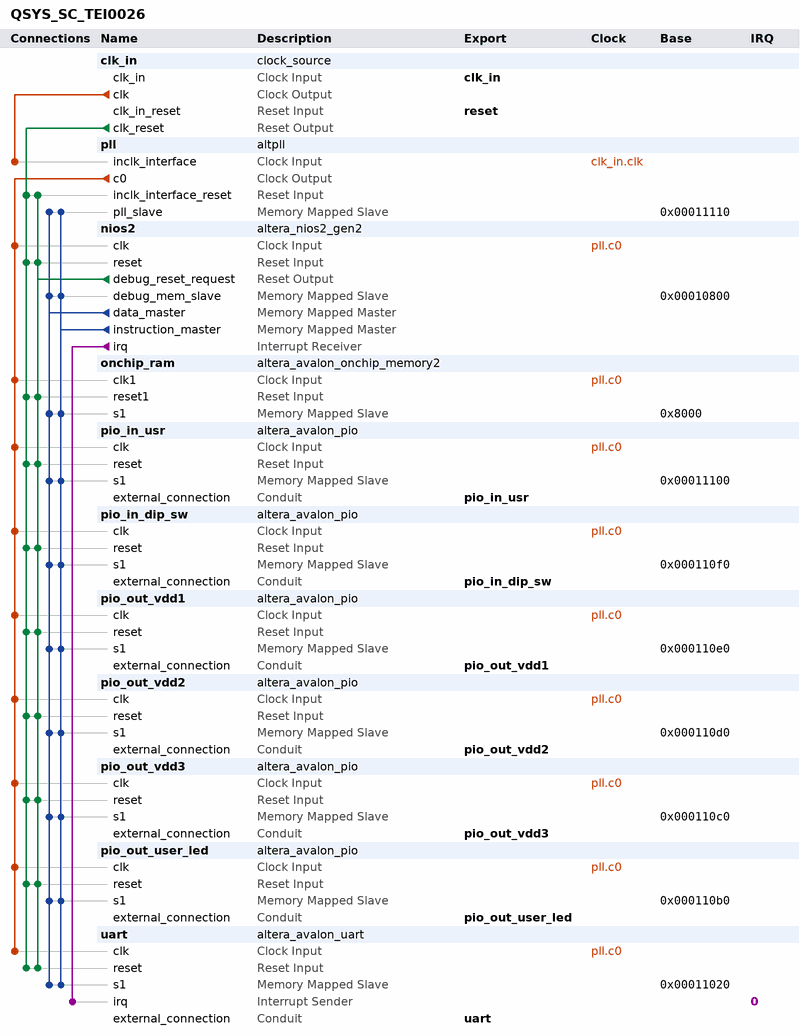
[diagram p0: system contents]
# Platform Designer (Qsys) system QSYS_SC_TEI0026, MAX 10 10M08SAU169C8G
# Parameters at their usual value, and those the tool derives, are not listed.
package require -exact qsys 19.1
create_system QSYS_SC_TEI0026
set_project_property DEVICE_FAMILY {MAX 10}
set_project_property DEVICE 10M08SAU169C8G

add_instance clk_in clock_source 19.1
set_instance_parameter_value clk_in clockFrequency 12000000

add_instance pll altpll 19.1
set_instance_parameter_value pll CLK0_DIVIDE_BY 3
set_instance_parameter_value pll CLK0_MULTIPLY_BY 25
set_instance_parameter_value pll INCLK0_INPUT_FREQUENCY 83333
set_instance_parameter_value pll PORT_ARESET PORT_UNUSED
set_instance_parameter_value pll PORT_LOCKED PORT_UNUSED
set_instance_parameter_value pll PORT_clk1 PORT_UNUSED
set_instance_parameter_value pll PORT_clk2 PORT_UNUSED
set_instance_parameter_value pll PORT_clk3 PORT_UNUSED

add_instance nios2 altera_nios2_gen2 19.1
set_instance_parameter_value nios2 dcache_size 2048
set_instance_parameter_value nios2 exceptionSlave onchip_ram.s1
set_instance_parameter_value nios2 icache_size 4096
set_instance_parameter_value nios2 impl Tiny
set_instance_parameter_value nios2 resetSlave onchip_ram.s1

add_instance onchip_ram altera_avalon_onchip_memory2 19.1
set_instance_parameter_value onchip_ram dataWidth 32
set_instance_parameter_value onchip_ram dualPort false
set_instance_parameter_value onchip_ram initMemContent true
set_instance_parameter_value onchip_ram initializationFileName ./software/SC_TEI0026/mem_init/onchip_ram.hex
set_instance_parameter_value onchip_ram memorySize 32768
set_instance_parameter_value onchip_ram useNonDefaultInitFile true

add_instance pio_in_usr altera_avalon_pio 19.1
set_instance_parameter_value pio_in_usr direction Input
set_instance_parameter_value pio_in_usr width 3

add_instance pio_in_dip_sw altera_avalon_pio 19.1
set_instance_parameter_value pio_in_dip_sw direction Input
set_instance_parameter_value pio_in_dip_sw width 4

add_instance pio_out_vdd1 altera_avalon_pio 19.1
set_instance_parameter_value pio_out_vdd1 direction Output
set_instance_parameter_value pio_out_vdd1 width 5

add_instance pio_out_vdd2 altera_avalon_pio 19.1
set_instance_parameter_value pio_out_vdd2 direction Output
set_instance_parameter_value pio_out_vdd2 width 6

add_instance pio_out_vdd3 altera_avalon_pio 19.1
set_instance_parameter_value pio_out_vdd3 direction Output
set_instance_parameter_value pio_out_vdd3 width 5

add_instance pio_out_user_led altera_avalon_pio 19.1
set_instance_parameter_value pio_out_user_led direction Output
set_instance_parameter_value pio_out_user_led width 4

add_instance uart altera_avalon_uart 19.1
set_instance_parameter_value uart baud 115200
set_instance_parameter_value uart dataBits 8
set_instance_parameter_value uart fixedBaud true
set_instance_parameter_value uart parity NONE
set_instance_parameter_value uart stopBits 1

# connections
add_connection clk_in.clk pll.inclk_interface clock
add_connection pll.c0 nios2.clk clock
add_connection pll.c0 onchip_ram.clk1 clock
add_connection pll.c0 pio_in_dip_sw.clk clock
add_connection pll.c0 pio_in_usr.clk clock
add_connection pll.c0 pio_out_user_led.clk clock
add_connection pll.c0 pio_out_vdd1.clk clock
add_connection pll.c0 pio_out_vdd2.clk clock
add_connection pll.c0 pio_out_vdd3.clk clock
add_connection pll.c0 uart.clk clock
add_connection clk_in.clk_reset nios2.reset reset
add_connection clk_in.clk_reset onchip_ram.reset1 reset
add_connection clk_in.clk_reset pio_in_dip_sw.reset reset
add_connection clk_in.clk_reset pio_in_usr.reset reset
add_connection clk_in.clk_reset pio_out_user_led.reset reset
add_connection clk_in.clk_reset pio_out_vdd1.reset reset
add_connection clk_in.clk_reset pio_out_vdd2.reset reset
add_connection clk_in.clk_reset pio_out_vdd3.reset reset
add_connection clk_in.clk_reset pll.inclk_interface_reset reset
add_connection clk_in.clk_reset uart.reset reset
add_connection nios2.debug_reset_request nios2.reset reset
add_connection nios2.debug_reset_request onchip_ram.reset1 reset
add_connection nios2.debug_reset_request pio_in_dip_sw.reset reset
add_connection nios2.debug_reset_request pio_in_usr.reset reset
add_connection nios2.debug_reset_request pio_out_user_led.reset reset
add_connection nios2.debug_reset_request pio_out_vdd1.reset reset
add_connection nios2.debug_reset_request pio_out_vdd2.reset reset
add_connection nios2.debug_reset_request pio_out_vdd3.reset reset
add_connection nios2.debug_reset_request pll.inclk_interface_reset reset
add_connection nios2.debug_reset_request uart.reset reset
add_connection nios2.data_master nios2.debug_mem_slave avalon
set_connection_parameter_value nios2.data_master/nios2.debug_mem_slave baseAddress 0x00010800
add_connection nios2.data_master onchip_ram.s1 avalon
set_connection_parameter_value nios2.data_master/onchip_ram.s1 baseAddress 0x8000
add_connection nios2.data_master pio_in_dip_sw.s1 avalon
set_connection_parameter_value nios2.data_master/pio_in_dip_sw.s1 baseAddress 0x000110f0
add_connection nios2.data_master pio_in_usr.s1 avalon
set_connection_parameter_value nios2.data_master/pio_in_usr.s1 baseAddress 0x00011100
add_connection nios2.data_master pio_out_user_led.s1 avalon
set_connection_parameter_value nios2.data_master/pio_out_user_led.s1 baseAddress 0x000110b0
add_connection nios2.data_master pio_out_vdd1.s1 avalon
set_connection_parameter_value nios2.data_master/pio_out_vdd1.s1 baseAddress 0x000110e0
add_connection nios2.data_master pio_out_vdd2.s1 avalon
set_connection_parameter_value nios2.data_master/pio_out_vdd2.s1 baseAddress 0x000110d0
add_connection nios2.data_master pio_out_vdd3.s1 avalon
set_connection_parameter_value nios2.data_master/pio_out_vdd3.s1 baseAddress 0x000110c0
add_connection nios2.data_master pll.pll_slave avalon
set_connection_parameter_value nios2.data_master/pll.pll_slave baseAddress 0x00011110
add_connection nios2.data_master uart.s1 avalon
set_connection_parameter_value nios2.data_master/uart.s1 baseAddress 0x00011020
add_connection nios2.instruction_master nios2.debug_mem_slave avalon
set_connection_parameter_value nios2.instruction_master/nios2.debug_mem_slave baseAddress 0x00010800
add_connection nios2.instruction_master onchip_ram.s1 avalon
set_connection_parameter_value nios2.instruction_master/onchip_ram.s1 baseAddress 0x8000
add_connection nios2.instruction_master pio_in_dip_sw.s1 avalon
set_connection_parameter_value nios2.instruction_master/pio_in_dip_sw.s1 baseAddress 0x000110f0
add_connection nios2.instruction_master pio_in_usr.s1 avalon
set_connection_parameter_value nios2.instruction_master/pio_in_usr.s1 baseAddress 0x00011100
add_connection nios2.instruction_master pio_out_user_led.s1 avalon
set_connection_parameter_value nios2.instruction_master/pio_out_user_led.s1 baseAddress 0x000110b0
add_connection nios2.instruction_master pio_out_vdd1.s1 avalon
set_connection_parameter_value nios2.instruction_master/pio_out_vdd1.s1 baseAddress 0x000110e0
add_connection nios2.instruction_master pio_out_vdd2.s1 avalon
set_connection_parameter_value nios2.instruction_master/pio_out_vdd2.s1 baseAddress 0x000110d0
add_connection nios2.instruction_master pio_out_vdd3.s1 avalon
set_connection_parameter_value nios2.instruction_master/pio_out_vdd3.s1 baseAddress 0x000110c0
add_connection nios2.instruction_master pll.pll_slave avalon
set_connection_parameter_value nios2.instruction_master/pll.pll_slave baseAddress 0x00011110
add_connection nios2.instruction_master uart.s1 avalon
set_connection_parameter_value nios2.instruction_master/uart.s1 baseAddress 0x00011020
add_connection nios2.irq uart.irq interrupt
set_connection_parameter_value nios2.irq/uart.irq irqNumber 0

# exported interfaces
add_interface clk_in clock sink
set_interface_property clk_in EXPORT_OF clk_in.clk_in
add_interface pio_in_dip_sw conduit end
set_interface_property pio_in_dip_sw EXPORT_OF pio_in_dip_sw.external_connection
add_interface pio_in_usr conduit end
set_interface_property pio_in_usr EXPORT_OF pio_in_usr.external_connection
add_interface pio_out_user_led conduit end
set_interface_property pio_out_user_led EXPORT_OF pio_out_user_led.external_connection
add_interface pio_out_vdd1 conduit end
set_interface_property pio_out_vdd1 EXPORT_OF pio_out_vdd1.external_connection
add_interface pio_out_vdd2 conduit end
set_interface_property pio_out_vdd2 EXPORT_OF pio_out_vdd2.external_connection
add_interface pio_out_vdd3 conduit end
set_interface_property pio_out_vdd3 EXPORT_OF pio_out_vdd3.external_connection
add_interface reset reset sink
set_interface_property reset EXPORT_OF clk_in.clk_in_reset
add_interface uart conduit end
set_interface_property uart EXPORT_OF uart.external_connection

set_interconnect_requirement {$system} qsys_mm.clockCrossingAdapter HANDSHAKE
set_interconnect_requirement {$system} qsys_mm.enableEccProtection FALSE
set_interconnect_requirement {$system} qsys_mm.insertDefaultSlave FALSE
set_interconnect_requirement {$system} qsys_mm.maxAdditionalLatency 1

save_system QSYS_SC_TEI0026.qsys
